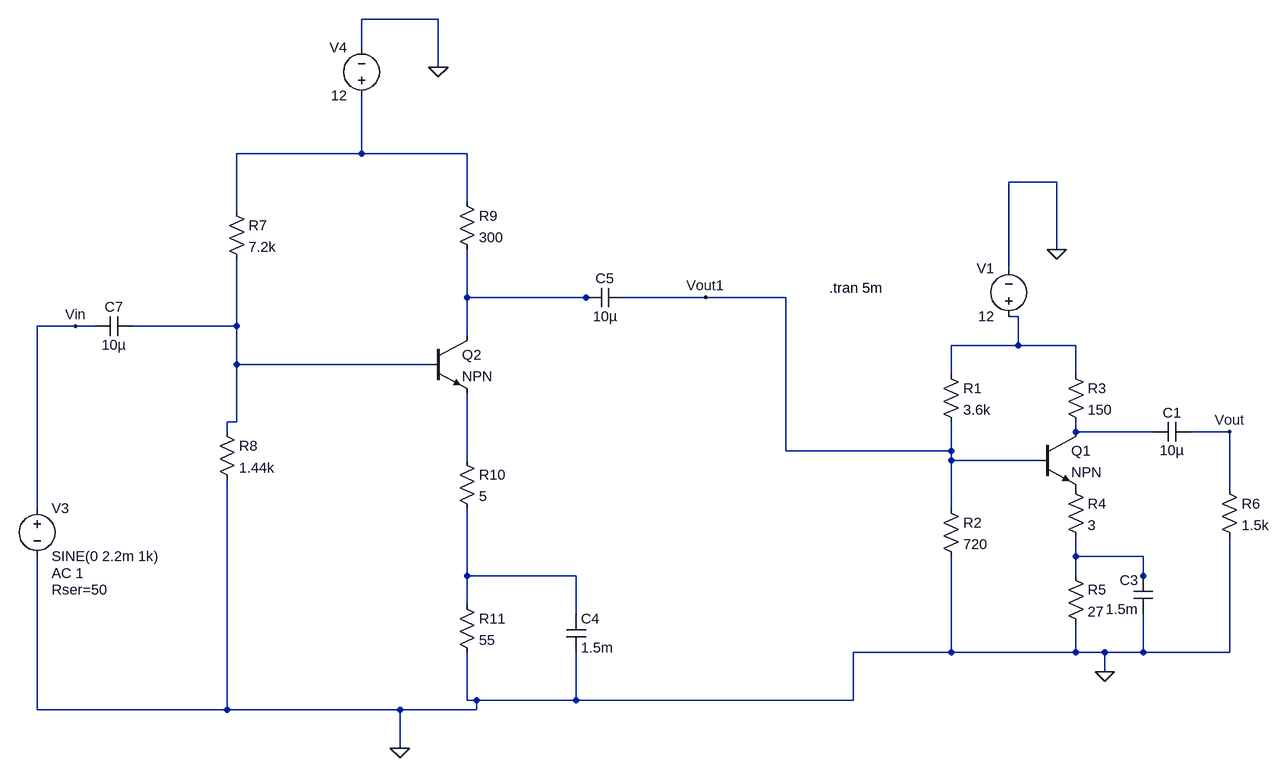
[diagram p0: schematic 2-stage_CE_Amplifier.asc]
2-stage_CE_Amplifier.asc, the LTspice schematic file:
Version 4.1
SHEET 1 880 680
WIRE -2128 -848 -2256 -848
WIRE -2256 -800 -2256 -848
WIRE -2128 -768 -2128 -848
WIRE -2256 -624 -2256 -720
WIRE -2256 -624 -2464 -624
WIRE -2080 -624 -2256 -624
WIRE 80 -576 0 -576
WIRE -2080 -544 -2080 -624
WIRE -2464 -528 -2464 -624
WIRE 80 -464 80 -576
WIRE 0 -432 0 -576
WIRE -2080 -384 -2080 -464
WIRE -1872 -384 -2080 -384
WIRE -1856 -384 -1872 -384
WIRE -1024 -384 -1808 -384
WIRE -448 -384 -1024 -384
WIRE 16 -352 0 -352
WIRE -2896 -336 -2960 -336
WIRE -2864 -336 -2896 -336
WIRE -2464 -336 -2464 -448
WIRE -2464 -336 -2800 -336
WIRE -2080 -320 -2080 -384
WIRE 16 -304 16 -352
WIRE 16 -304 -96 -304
WIRE 112 -304 16 -304
WIRE -2464 -272 -2464 -336
WIRE -2144 -272 -2464 -272
WIRE -96 -256 -96 -304
WIRE 112 -256 112 -304
WIRE -2464 -176 -2464 -272
WIRE -2464 -176 -2480 -176
WIRE -2480 -160 -2480 -176
WIRE 112 -160 112 -176
WIRE 240 -160 112 -160
WIRE 368 -160 304 -160
WIRE -448 -128 -448 -384
WIRE -96 -128 -96 -176
WIRE -96 -128 -448 -128
WIRE -2080 -112 -2080 -224
WIRE -96 -112 -96 -128
WIRE 48 -112 -96 -112
WIRE 368 -64 368 -160
WIRE -2960 -32 -2960 -336
WIRE -96 -32 -96 -112
WIRE 112 48 112 16
WIRE 224 48 112 48
WIRE -2080 80 -2080 -32
WIRE -1888 80 -2080 80
WIRE 112 80 112 48
WIRE 224 80 224 48
WIRE 224 96 224 80
WIRE -2080 128 -2080 80
WIRE -1888 144 -1888 80
WIRE -96 208 -96 48
WIRE -96 208 -336 208
WIRE 112 208 112 160
WIRE 112 208 -96 208
WIRE 160 208 112 208
WIRE 224 208 224 144
WIRE 224 208 160 208
WIRE 368 208 368 16
WIRE 368 208 224 208
WIRE 160 240 160 208
WIRE -2080 288 -2080 208
WIRE -2064 288 -2080 288
WIRE -1888 288 -1888 208
WIRE -1888 288 -2064 288
WIRE -336 288 -336 208
WIRE -336 288 -1888 288
WIRE -2960 304 -2960 48
WIRE -2480 304 -2480 -80
WIRE -2480 304 -2960 304
WIRE -2192 304 -2480 304
WIRE -2064 304 -2064 288
WIRE -2064 304 -2192 304
WIRE -2192 368 -2192 304
FLAG 80 -464 0
FLAG 160 240 0
FLAG 368 -160 Vout
FLAG -2128 -768 0
FLAG -2192 368 0
FLAG -2896 -336 Vin
FLAG -1024 -384 Vout1
SYMBOL res -112 -272 R0
SYMATTR InstName R1
SYMATTR Value 3.6k
SYMBOL res -112 -48 R0
SYMATTR InstName R2
SYMATTR Value 720
SYMBOL res 96 -272 R0
SYMATTR InstName R3
SYMATTR Value 150
SYMBOL res 96 -80 R0
SYMATTR InstName R4
SYMATTR Value 3
SYMBOL res 96 64 R0
SYMATTR InstName R5
SYMATTR Value 27
SYMBOL res 352 -80 R0
SYMATTR InstName R6
SYMATTR Value 1.5k
SYMBOL cap 304 -176 R90
WINDOW 0 0 32 VBottom 2
WINDOW 3 32 32 VTop 2
SYMATTR InstName C1
SYMATTR Value 10µ
SYMBOL cap 240 144 R180
WINDOW 0 24 56 Left 2
WINDOW 3 24 8 Left 2
SYMATTR InstName C3
SYMATTR Value 1.5m
SYMBOL npn 48 -160 R0
SYMATTR InstName Q1
SYMBOL voltage 0 -336 R180
WINDOW 0 24 96 Left 2
WINDOW 3 24 16 Left 2
WINDOW 123 0 0 Left 0
WINDOW 39 0 0 Left 0
SYMATTR InstName V1
SYMATTR Value 12
SYMBOL res -2480 -544 R0
SYMATTR InstName R7
SYMATTR Value 7.2k
SYMBOL res -2496 -176 R0
SYMATTR InstName R8
SYMATTR Value 1.44k
SYMBOL res -2096 -560 R0
SYMATTR InstName R9
SYMATTR Value 300
SYMBOL res -2096 -128 R0
SYMATTR InstName R10
SYMATTR Value 5
SYMBOL res -2096 112 R0
SYMATTR InstName R11
SYMATTR Value 55
SYMBOL cap -1904 144 R0
SYMATTR InstName C4
SYMATTR Value 1.5m
SYMBOL cap -1808 -400 R90
WINDOW 0 0 32 VBottom 2
WINDOW 3 32 32 VTop 2
SYMATTR InstName C5
SYMATTR Value 10µ
SYMBOL cap -2800 -352 R90
WINDOW 0 0 32 VBottom 2
WINDOW 3 32 32 VTop 2
SYMATTR InstName C7
SYMATTR Value 10µ
SYMBOL npn -2144 -320 R0
SYMATTR InstName Q2
SYMBOL voltage -2960 -48 R0
WINDOW 123 24 124 Left 2
WINDOW 39 24 152 Left 2
SYMATTR InstName V3
SYMATTR Value SINE(0 2.2m 1k)
SYMATTR Value2 AC 1
SYMATTR SpiceLine Rser=50
SYMBOL voltage -2256 -704 R180
WINDOW 0 24 96 Left 2
WINDOW 3 24 16 Left 2
WINDOW 123 0 0 Left 0
WINDOW 39 0 0 Left 0
SYMATTR InstName V4
SYMATTR Value 12
TEXT -376 -400 Left 2 !.tran 5m

The netlist it stands for:
* 2-stage_CE_Amplifier.asc
R1 N003 Vout1 3.6k
R2 Vout1 0 720
R3 N003 N005 150
R4 P001 N007 3
R5 N007 0 27
R6 Vout 0 1.5k
C1 Vout N005 10µ
C3 0 N007 1.5m
Q1 N005 Vout1 P001 0 NPN
V1 N003 0 12
R7 N001 N004 7.2k
R8 N004 0 1.44k
R9 N001 N002 300
R10 N006 N008 5
R11 N008 0 55
C4 N008 0 1.5m
C5 Vout1 N002 10µ
C7 N004 Vin 10µ
Q2 N002 N004 N006 0 NPN
V3 Vin 0 SINE(0 2.2m 1k) AC 1 Rser=50
V4 N001 0 12
.model NPN NPN
.model PNP PNP
.lib standard.bjt
.tran 5m
.backanno
.end